# EasyEDA Pro project ProPrj_USB_Hub_2026-06-01.epro

# Schematic Schematic1
Board Name: Board1; Create Date: 2026-05-16; Page Name: P1; Project Name: USB_Hub; Schematic Name: Schematic1; Update Date: 2026-05-16; Company: EasyEDA.com; Page Size: A4; Version: V1.0
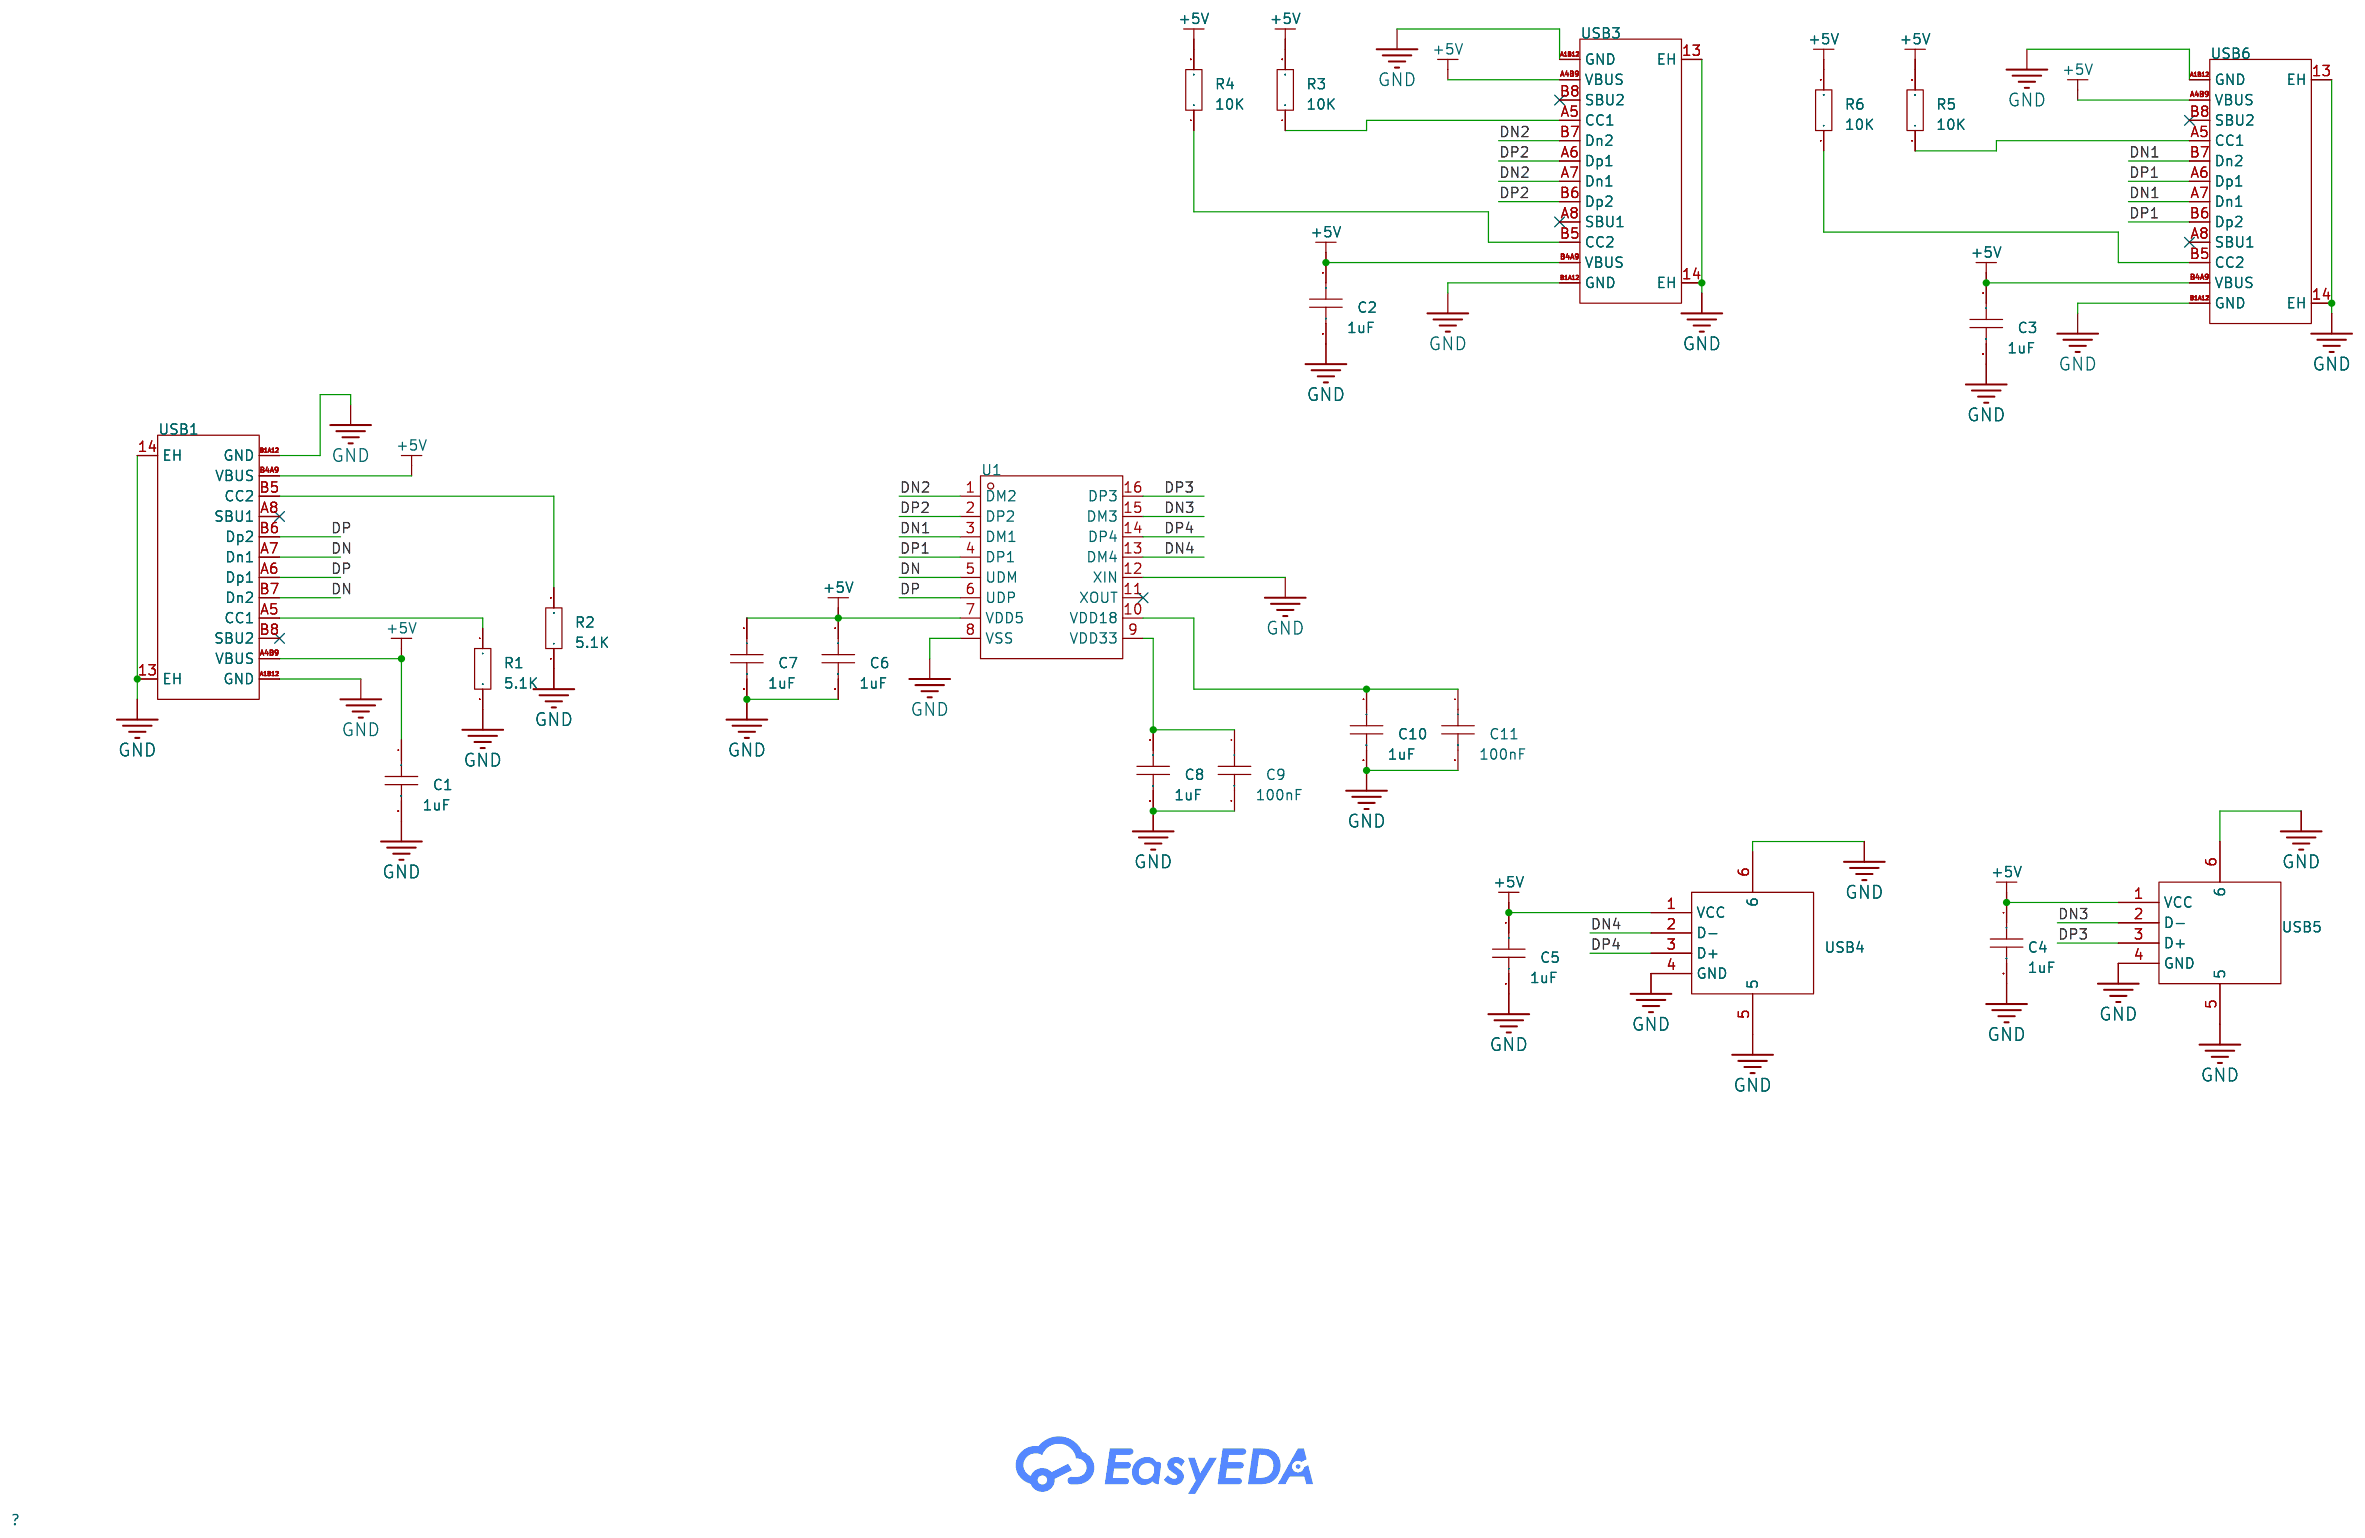
[diagram p0: schematic sheet]

## Parts
C1  1uF  [C0603]
C2  1uF  [C0603]
C3  1uF  [C0603]
C4  1uF  [C0603]
C5  1uF  [C0603]
C6  1uF  [C0603]
C7  1uF  [C0603]
C8  1uF  [C0603]
C9  100nF  [C0603]
C10  1uF  [C0603]
C11  100nF  [C0603]
R1  5.1K  [R0603]
R2  5.1K  [R0603]
R3  10K  [R0603]
R4  10K  [R0603]
R5  10K  [R0603]
R6  10K  [R0603]
U1  SL2.1s  [SSOP-16_L4.6-W2.6-P0.53-LS4.0-BL]
USB1  TYPE-C 16PIN 2MD(073)  [USB-C-SMD_TYPE-C-16PIN-2MD-073]
USB3  TYPE-C 16PIN 2MD(073)  [USB-C-SMD_TYPE-C-16PIN-2MD-073]
USB4  10.0 QHHTZB6.3  [USB-A-TH_10.0QHHTZB6.3]
USB5  10.0 QHHTZB6.3  [USB-A-TH_10.0QHHTZB6.3]
USB6  TYPE-C 16PIN 2MD(073)  [USB-C-SMD_TYPE-C-16PIN-2MD-073]

## Library data of the parts
C1-C11 = CAP_0603: Supplier Footprint: 0603
R1-R6 = Res_0603: Supplier Footprint: 0603
U1 = SL2.1s: type:Hub USB Protocol:USB 2.0 Data Rate:- Voltage - Supply:4V~5.25V Voltage - Supply:4V~5.25V Operating Temperature:0℃~+70℃ Operating Temperature:0℃~+70℃ Memory Interface:- Current - Supply:120mA Quiescent Supply Current:2.5mA Number of Channels:4; LCSC Part Name: USB2.0 HUB控制器集成电路; Supplier Part: C2684433; Manufacturer: CoreChips(和芯润德); Supplier Footprint: SSOP-16; JLCPCB Part Class: Extended Part; Datasheet: https://item.szlcsc.com/datasheet/SL2.1s/2782346.html; Supplier: LCSC; type: Hub; USB Protocol: USB 2.0; Voltage - Supply: 4V~5.25V; Operating Temperature: 0℃~+70℃; Current - Supply: 120mA; Quiescent Supply Current: 2.5mA; Number of Channels: 4
USB1 USB3 USB6 = TYPE-C 16PIN 2MD(073): Connector Type:Type-C Protocol Standard:- Gender:Female Mounting Type:Surface Mount, Right Angle Number of Contacts:16P Number of Ports:1 Current Rating-Power:3A Voltage Rating:5V Connect-Disconnect Life:10,000 Cycles Supplementary Features:- Center Heigh; LCSC Part Name: Type-C 母 卧贴; Supplier Part: C2765186; Manufacturer: SHOU HAN(首韩); Supplier Footprint: SMD; JLCPCB Part Class: Extended Part; Datasheet: https://item.szlcsc.com/datasheet/TYPE-C%252016PIN%25202MD(073)/2901843.html; Supplier: LCSC; Connector Type: Type-C; Gender: Female; Mounting Type: Surface Mount, Right Angle; Number of Contacts: 16P; Number of Ports: 1; Current Rating-Power: 3A; Voltage Rating: 5V; Connect-Disconnect Life: 10,000 Cycles; Detection color: Black; Operating Temperature: -25℃~+85℃
USB4 USB5 = 10.0 QHHTZB6.3: Connector Type:Type-A Protocol Standard:USB 2.0 Gender:Female Mounting Type:Surface Mount, Right Angle Number of Contacts:4P Number of Ports:1 Current Rating-Power:1.5A Voltage Rating:30V Connect-Disconnect Life:5,000 times Supplementary Features:- Center; LCSC Part Name: 壳长10.0mm; Supplier Part: C668591; Manufacturer: SHOU HAN(首韩); Supplier Footprint: SMD; JLCPCB Part Class: Extended Part; Datasheet: https://item.szlcsc.com/datasheet/10.0%2520QHHTZB6.3/698534.html; Supplier: LCSC; Connector Type: Type-A; Protocol Standard: USB 2.0; Gender: Female; Mounting Type: Surface Mount, Right Angle; Number of Contacts: 4P; Number of Ports: 1; Current Rating-Power: 1.5A; Voltage Rating: 30V; Connect-Disconnect Life: 5,000 times; Length: 10mm; Detection color: Black; Operating Temperature: -25℃~+85℃

## Nets
+5V: C1.1 C2.1 C3.1 C4.1 C5.1 C6.1 C7.1 R3.2 R4.2 R5.2 R6.2 U1.7(VDD5) USB1.A4B9(VBUS) USB1.B4A9(VBUS) USB3.A4B9(VBUS) USB3.B4A9(VBUS) USB4.1(VCC) USB5.1(VCC) USB6.A4B9(VBUS) USB6.B4A9(VBUS)
GND: C1.2 C2.2 C3.2 C4.2 C5.2 C6.2 C7.2 C8.2 C9.2 C10.2 C11.2 R1.2 R2.1 U1.8(VSS) U1.12(XIN) USB1.13(EH) USB1.14(EH) USB1.A1B12(GND) USB1.B1A12(GND) USB3.13(EH) USB3.14(EH) USB3.A1B12(GND) USB3.B1A12(GND) USB4.4(GND) USB4.5 USB4.6 USB5.4(GND) USB5.5 USB5.6 USB6.13(EH) USB6.14(EH) USB6.A1B12(GND) USB6.B1A12(GND)
DN: U1.5(UDM) USB1.A7(Dn1) USB1.B7(Dn2)
DN1: U1.3(DM1) USB6.A7(Dn1) USB6.B7(Dn2)
DN2: U1.1(DM2) USB3.A7(Dn1) USB3.B7(Dn2)
DN3: U1.15(DM3) USB5.2(D-)
DN4: U1.13(DM4) USB4.2(D-)
DP: U1.6(UDP) USB1.A6(Dp1) USB1.B6(Dp2)
DP1: U1.4(DP1) USB6.A6(Dp1) USB6.B6(Dp2)
DP2: U1.2(DP2) USB3.A6(Dp1) USB3.B6(Dp2)
DP3: U1.16(DP3) USB5.3(D+)
DP4: U1.14(DP4) USB4.3(D+)
$1N1062: R1.1 USB1.A5(CC1)
$1N1067: R2.2 USB1.B5(CC2)
$1N1498: R3.1 USB3.A5(CC1)
$1N1505: R4.1 USB3.B5(CC2)
$1N1791: R6.1 USB6.B5(CC2)
$1N1796: R5.1 USB6.A5(CC1)
$1N2431: C8.1 C9.1 U1.9(VDD33)
$1N2658: C10.1 C11.1 U1.10(VDD18)

Not connected (* = marked no-connect by the designer): U1 11(XOUT)*; USB1 A8(SBU1)* B8(SBU2)*; USB3 A8(SBU1)* B8(SBU2)*; USB6 A8(SBU1)* B8(SBU2)*

# Board PCB1
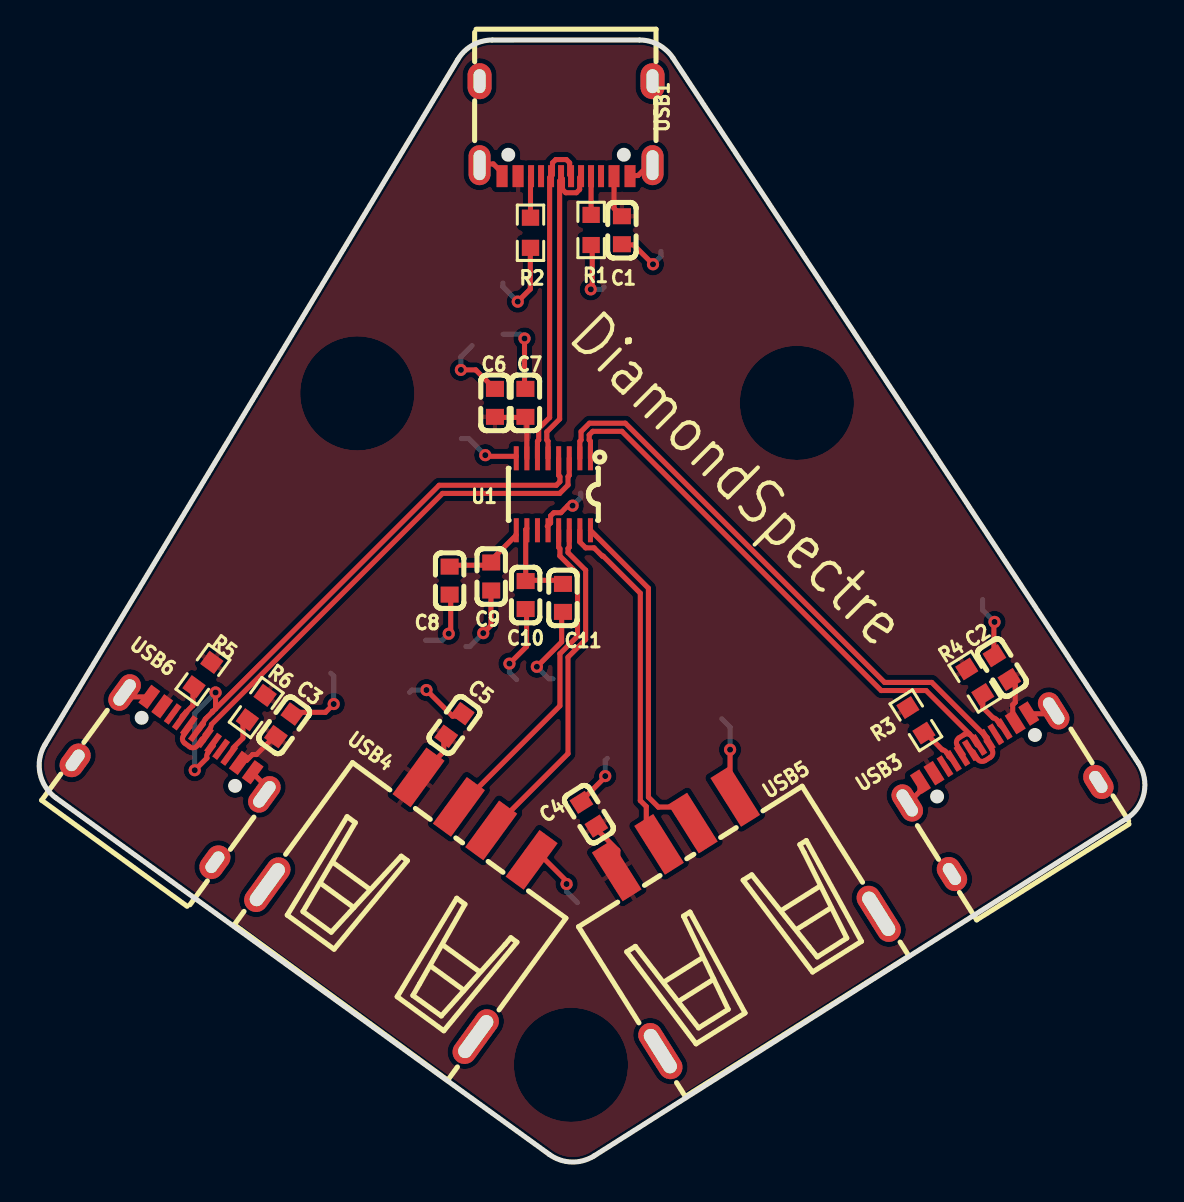
[diagram p1: board, top side]
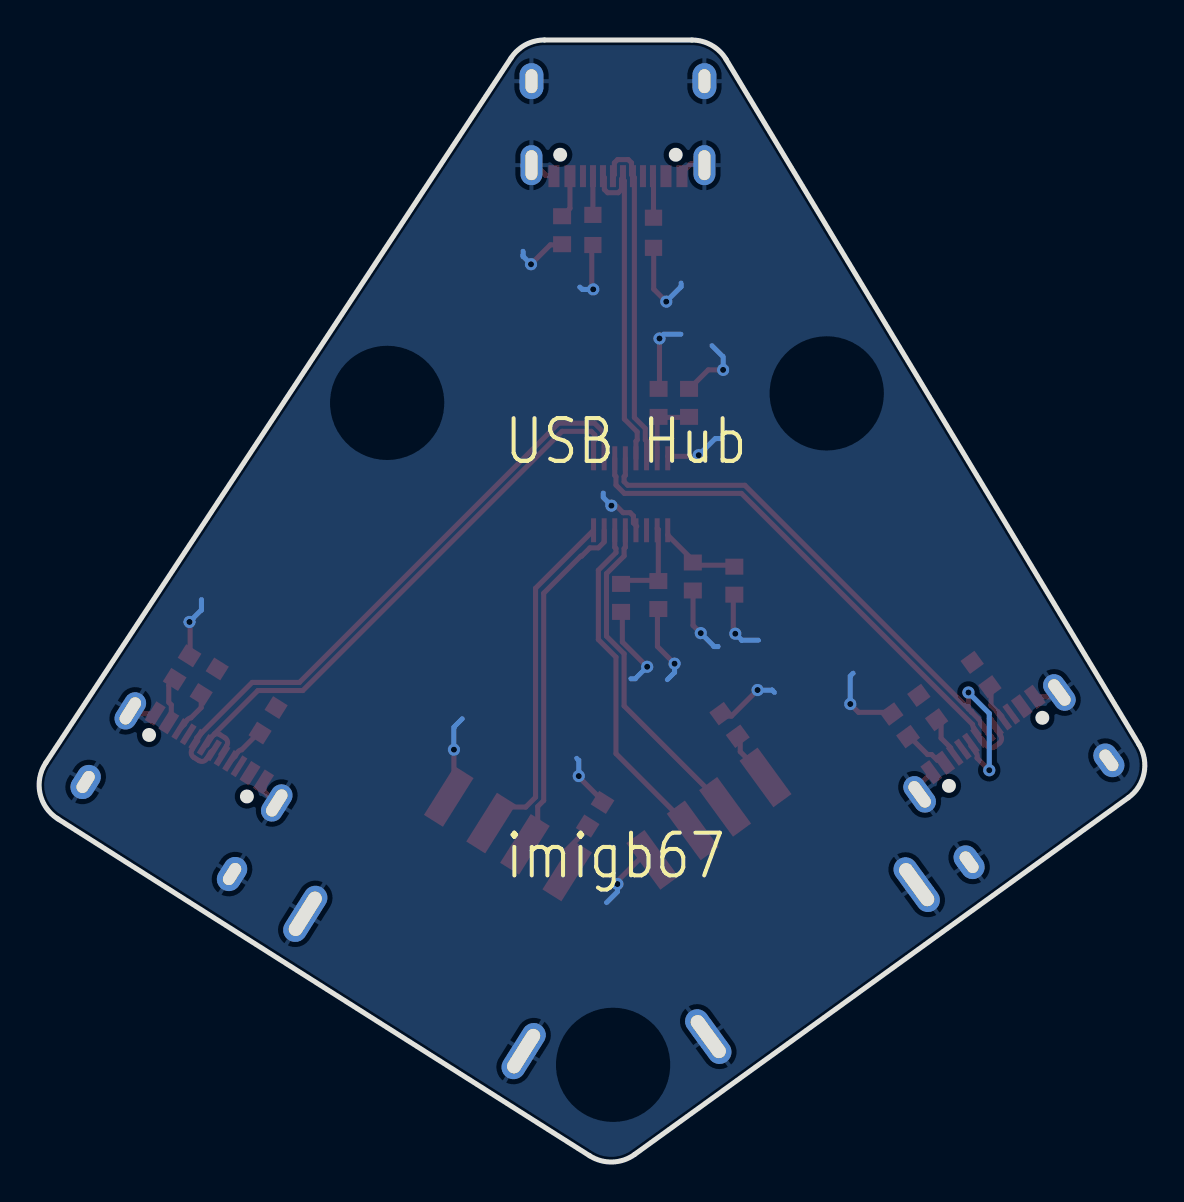
[diagram p2: board, bottom side, seen from below]

Outline 55.21 x 56.12 mm; copper layers: Top Layer, Bottom Layer. Coordinates in mm from the lower left corner of the outline.
Outline path: 0.79,18.22 arc(0,19.44) 0.25,20.87 20.9,55.15 arc(21.63,55.86) 22.61,56.12 29.98,56.12 arc(30.93,55.89) 31.65,55.23 54.93,19.96 arc(55.21,18.44) 54.33,17.17 27.72,0.31 arc(26.59,0) 25.48,0.38 0.79,18.22
Stack: Top Layer 0.035mm / Dielectric1 1.51mm FR4 er 4.5 / Bottom Layer 0.035mm

## Design rules (mm)
net DN2: DP4
net DP2: DP4
net DN1: DP3
net DP1: DP3
net DN: DP5
net DP: DP5
net DN4: DP1
net DP4: DP1
net DN3: DP2
net DP3: DP2
template: Custom Config
spacing copperThickness1oz (default): track to track 0.102, other pairs 0.152 to 0.3
spacing copperThickness2oz: track to track 0.203, other pairs 0.152 to 0.3
track width copperThickness1oz (default): min 0.127, default 0.254, max 2.54
track width copperThickness2oz: min 0.203, default 0.254, max 2.54
differential pair differentialPair (default): width min 0.127, default 0.254, max 2.54; gap min 0.152, default 0.152
via viaSize (default): diameter min 0.5, default 0.61, max 10; hole min 0.3, default 0.305, max 6.3

## Placement (name value [footprint] x y rotation side)
C1  1uF  [C0603]  29.1 46.61 270 top
C2  1uF  [C0603]  48.11 24.73 122.2 top
C3  1uF  [C0603]  12.21 21.84 53.9 top
C4  1uF  [C0603]  27.45 17.4 122.2 top
C5  1uF  [C0603]  20.73 21.86 53.9 top
C6  1uF  [C0603]  22.75 37.97 90 top
C7  1uF  [C0603]  24.28 37.97 90 top
C8  1uF  [C0603]  20.49 29.08 270 top
C9  100nF  [C0603]  22.57 29.29 270 top
C10  1uF  [C0603]  24.29 28.36 270 top
C11  100nF  [C0603]  26.15 28.22 270 top
R1  5.1K  [R0603]  27.56 46.62 270 top
R2  5.1K  [R0603]  24.53 46.48 90 top
R3  10K  [R0603]  43.81 22.09 122.2 top
R4  10K  [R0603]  46.75 24.03 122.2 top
R5  10K  [R0603]  8.15 24.38 53.9 top
R6  10K  [R0603]  10.82 22.73 53.9 top
U1  SL2.1s  [SSOP-16_L4.6-W2.6-P0.53-LS4.0-BL]  25.67 33.4 180 top
USB1  TYPE-C 16PIN 2MD(073)  [USB-C-SMD_TYPE-C-16PIN-2MD-073]  26.31 51.69 180 top
USB3  TYPE-C 16PIN 2MD(073)  [USB-C-SMD_TYPE-C-16PIN-2MD-073]  48.01 18.72 32.2 top
USB4  10.0 QHHTZB6.3  [USB-A-TH_10.0QHHTZB6.3]  19.17 13.62 323.9 top
USB5  10.0 QHHTZB6.3  [USB-A-TH_10.0QHHTZB6.3]  34.15 12.7 32.2 top
USB6  TYPE-C 16PIN 2MD(073)  [USB-C-SMD_TYPE-C-16PIN-2MD-073#2]  6.65 19.46 323.9 top

## Footprints (pads in the part's own frame, mm; a bottom-side part is the same pattern mirrored in y, then rotated)
C0603
  rect 0.8x0.9 smd: 1(-0.7,0) 2(0.7,0)
R0603
  rect 0.806x0.864 smd: 1(-0.753,0) 2(0.753,0)
SSOP-16_L4.6-W2.6-P0.53-LS4.0-BL
  rect 0.25x1.2 smd: 1(-1.855,-1.8) 2(-1.325,-1.8) 3(-0.795,-1.8) 4(-0.265,-1.8) 5(0.265,-1.8) 6(0.795,-1.8) 7(1.325,-1.8) 8(1.855,-1.8) 9(1.855,1.8) 10(1.325,1.8) 11(0.795,1.8) 12(0.265,1.8) 13(-0.265,1.8) 14(-0.795,1.8) 15(-1.325,1.8) 16(-1.855,1.8)
USB-A-TH_10.0QHHTZB6.3
  rect 1.12x2.88 smd: 1(-3.5,4.395) 2(-1,4.395) 3(1,4.395) 4(3.5,4.395)
  oval 1.2x3.1 hole 0.7x2.5: 5(-6.45,-4.395) 6(6.45,-4.395)
USB-C-SMD_TYPE-C-16PIN-2MD-073
  oval 1.1x2 hole 0.6x1.5: 13(-4.325,1.825) 14(4.325,1.825)
  oval 1.2x1.8 hole 0.6x1.2: 13(-4.325,-2.375) 14(4.325,-2.375)
  rect 0.55x1.1 smd: A1B12(-3.2,2.375) A4B9(-2.4,2.375) B1A12(3.2,2.375) B4A9(2.4,2.375)
  rect 0.3x1.1 smd: A5(-1.25,2.375) A6(-0.25,2.375) A7(0.25,2.375) A8(1.25,2.375) B5(1.75,2.375) B6(0.75,2.375) B7(-0.75,2.375) B8(-1.75,2.375)
USB-C-SMD_TYPE-C-16PIN-2MD-073#2
  oval 1.1x2 hole 0.6x1.5: 13(-4.325,1.825) 14(4.325,1.825)
  oval 1.2x1.8 hole 0.6x1.2: 13(-4.325,-2.375) 14(4.325,-2.375)
  rect 0.55x1.1 smd: A1B12(-3.2,2.375) A4B9(-2.4,2.375) B1A12(3.2,2.375) B4A9(2.4,2.375)
  rect 0.3x1.1 smd: A5(-1.25,2.375) A6(-0.25,2.375) A7(0.25,2.375) A8(1.25,2.375) B5(1.75,2.375) B6(0.75,2.375) B7(-0.75,2.375) B8(-1.75,2.375)

## Nets
As in the schematic.

Pads without a net: U1 11; USB1 A8 B8; USB3 A8 B8; USB6 A8 B8

## Via types
v1: diameter 0.61, hole 0.305, Top Layer to Bottom Layer, 19 vias

## Routing (per net, layer and track width the routed paths; a pad name or vN(x,y) marks a point on that pad's centre or on a via; arc(x,y) is an arc through that point)
+5V: length 15.1
  Top Layer w0.254: C2.1 48.77,23.84 48.77,22.99 48.65,22.87 48.65,22.29 48.77,22.16 USB3.B4A9 ; 11.7,21.26 10.83,20.38 10.62,20.38 10.34,20.1 10.08,20.1 ; 22.72,37.25 24.25,37.25 24.27,37.28 ; 24.35,35.2 24.35,37.2 ; C1.1 28.71,47.7 USB1.A4B9 ; 28.9,14.6 28.9,15.59 27.76,16.72 ; 20.19,21.24 20.19,20.52 19.08,19.41
GND: length 65.9
  Top Layer w0.254: v1(14.69,22.91) 14.28,22.49 12.64,22.49 ; v1(22.17,26.45) 22.55,26.84 22.55,28.72 ; v1(24.85,24.77) 26.09,26.01 26.09,27.53 ; 49.38,22.42 50.55,22.42 50.7,22.56 ; v1(27.55,43.65) 27.62,43.72 27.62,45.82 ; v1(23.48,24.93) 24.33,25.78 24.33,27.63 ; 30.34,49.77 29.91,49.34 29.46,49.34 ; v1(21.05,39.62) 21.79,39.62 22.75,38.67 ; v1(24.23,41.19) 24.23,38.85 24.12,38.74 ; v1(23.89,43.04) 24.52,43.66 24.52,45.68 ; v1(34.51,20.63) 34.51,19.03 34.86,18.69 ; 25.37,31.8 25.54,31.96 25.54,32.32 25.7,32.48 26.05,32.48 26.4,32.83 v1(26.64,32.83) ; 23.15,49.45 22.67,49.92 21.84,49.92 ; 24.92,15.46 26.34,14.05 v1(26.34,13.9) ; 27.07,18.06 28.27,19.26 v1(28.27,19.3) ; 10.58,19.51 11.23,18.87 11.23,18.51 ; 43.29,17.82 44,18.54 44,18.95 ; v1(19.33,23.61) 20.63,22.3 21,22.3 21.18,22.48 ; 23.83,35.3 22.33,35.3 v1(22.27,35.36) ; 20.54,28.37 20.54,26.53 v1(20.44,26.43) ; 47.71,25.42 47.71,26.98 v1(47.74,27.01) ; v1(30.66,44.91) 29.69,45.88 29.07,45.88 ; 4.24,23.51 4.48,23.27 5.5,23.27
  Bottom Layer w0.254: 18.49,23.49 18.6,23.61 v1(19.33,23.61) ; 28.37,20.19 28.27,20.09 v1(28.27,19.3) ; 31.06,45.55 31.06,45.31 v1(30.66,44.91) ; 28.22,43.76 28.1,43.65 v1(27.55,43.65) ; 25.66,24.17 25.45,24.17 v1(24.85,24.77) ; v1(14.69,22.91) 14.69,24.31 14.55,24.45 ; v1(47.74,27.01) 47.14,27.61 47.14,28.13 ; v1(26.34,13.9) 26.34,13.52 26.88,12.98 ; 23.16,41.41 24.02,41.41 v1(24.23,41.19) ; 23.15,43.96 23.15,43.78 v1(23.89,43.04) ; v1(20.44,26.43) 20.11,26.1 19.29,26.1 ; 21.3,25.78 21.5,25.78 v1(22.17,26.45) ; v1(26.64,32.83) 27.04,33.24 27.04,33.46 ; 23.83,24.13 23.48,24.49 v1(23.48,24.93) ; v1(22.27,35.36) 21.44,36.18 21.07,36.18 ; v1(21.05,39.62) 21.05,40.28 21.61,40.84 ; v1(34.51,20.63) 34.51,21.75 34.1,22.17
DN: length 16.8
  Top Layer w0.254: 25.41,35.2 25.41,36.05 25.35,36.12 25.35,36.52 25.99,37.16 25.99,49.07 26.06,49.14 USB1.A7 26.08,49.29 26.08,49.22 26.13,49.17 26.13,48.65 26.29,48.48 26.82,48.48 26.99,48.65 26.99,49.24 USB1.B7
DN1: length 27.2
  Top Layer w0.254: USB6.B7 7.5,21.77 7.18,21.34 arc(7.13,21.13) 7.24,20.95 7.48,20.77 arc(7.69,20.72) 7.87,20.83 8.11,21.16 8.17,21.1 8.19,21.1 ; U1.3 26.47,34.35 26.41,34.28 26.41,33.86 25.99,33.44 20.13,33.44 8.57,21.89 arc(8.56,21.8) 8.52,21.72 8.25,21.36 USB6.A7
DN2: length 28.9
  Top Layer w0.254: 46.11,20.33 46.16,20.38 45.87,20.83 arc(45.84,21.04) 45.96,21.22 46.22,21.38 arc(46.35,21.42) 46.48,21.39 ; U1.1 27.53,36.05 27.47,36.12 27.47,36.37 27.65,36.55 29.1,36.55 42.07,23.58 44.32,23.58 46.48,21.42 46.48,21.39 ; USB3.A7 46.87,20.86 46.6,21.29 arc(46.55,21.35) 46.48,21.39
DN3: length 18.1
  Top Layer w0.254: 31.38,15.63 30.32,16.69 30.32,17.78 30.02,18.08 30.02,28.45 28.17,30.31 28.12,30.31 27.71,30.72 27.29,30.72 27,31.01 U1.15
DN4: length 16.7
  Top Layer w0.254: 20.95,17.76 26,22.82 26,25.42 26.88,26.3 26.88,29.43 26,30.31 26,30.68 25.94,30.75 U1.13
DP: length 16.8
  Top Layer w0.254: U1.6 24.88,36.05 24.94,36.12 24.94,36.69 25.49,37.24 25.49,49.24 USB1.B6 25.63,49.38 25.63,49.98 25.79,50.14 26.32,50.14 26.49,49.98 26.49,49.38 USB1.A6
DP1: length 31.5
  Top Layer w0.254: U1.4 25.94,34.35 26,34.28 26,34.03 25.82,33.85 19.96,33.85 8.78,22.67 ; USB6.A6 7.95,21.63 8.17,21.93 arc(8.21,22.06) 8.29,22.17 8.62,22.51 ; 8.78,22.67 8.62,22.51 ; 8.78,22.67 v1(8.78,23.48) ; 8.62,22.51 8.62,22.55 ; USB6.B6 8.66,20.82 8.39,20.45 arc(8.34,20.34) 8.35,20.21 v1(7.74,19.6)
  Bottom Layer w0.254: v1(7.74,19.6) 7.74,22.44 v1(8.78,23.48)
DP2: length 30.8
  Top Layer w0.254: U1.2 27,36.05 27.06,36.12 27.06,36.54 27.48,36.96 29.27,36.96 42.24,23.99 44.6,23.99 47.38,21.21 USB3.B6 47.33,21.08 47.61,20.62 arc(47.65,20.41) 47.52,20.24 47.27,20.08 arc(47.06,20.04) 46.88,20.17 46.67,20.51 arc(46.61,20.55) 46.56,20.6 USB3.A6
DP3: length 17.8
  Top Layer w0.254: 33.07,16.7 32.01,17.75 30.92,17.75 30.43,18.25 30.43,28.7 U1.16
DP4: length 17.4
  Top Layer w0.254: USB4.3 26.41,20.43 26.41,25.25 27.29,26.13 27.29,29.6 26.41,30.48 26.41,30.68 26.47,30.75 U1.14
$1N1062: length 1.9
  Top Layer w0.254: R1.1 27.56,49.31 USB1.A5
$1N1067: length 2.1
  Top Layer w0.254: R2.2 24.53,49.28 USB1.B5
$1N1498: length 2.1
  Top Layer w0.254: R3.1 44.29,21.46 45.13,20.62 arc(45.24,20.58) 45.33,20.49 45.46,20.29 45.68,20.06
$1N1505: length 2.2
  Top Layer w0.254: USB3.B5 48,21.89 47.87,22.09 arc(47.78,22.18) 47.67,22.22 47.15,22.73 47.15,23.39
$1N1791: length 1.6
  Top Layer w0.254: 9.66,20.71 10.15,21.2 10.15,22.13
$1N1796: length 1.7
  Top Layer w0.254: 7.11,22.3 7.65,22.84 7.65,23.74
$1N2431: length 4
  Top Layer w0.254: 22.5,30.05 22.31,29.85 20.38,29.85 ; 23.81,31.39 23.81,31.35 22.54,30.08
$1N2658: length 4.4
  Top Layer w0.254: 24.29,29.15 24.29,31.64 24.35,31.69 ; 24.35,29.1 25.93,29.1 26.1,28.92

## Copper pours and planes (outline as drawn; the poured copper is in the pictures)
+5V on Top Layer: -2.04,56.38 60.82,56.38 60.82,-0.62 -2.04,-0.62
+5V on Top Layer: -1.45,59.03 60.96,59.03 60.96,-2.74 -1.45,-2.74
+5V on Top Layer: -2.4,60.6 58.24,60.6 58.24,-4.26 -2.4,-4.26
GND on Bottom Layer: -2.81,59.04 59.07,59.04 59.07,-2.51 -2.81,-2.51

## Text on the board
Bottom Silkscreen Layer: imigb67 | USB Hub
Top Silkscreen Layer: DiamondSpectre
